# Altium schematic sheet Power.SchDoc
size A3; Author: Швецов С.В.; Organization: PapuaSoft; SheetNumber: 6; SheetTotal: 8
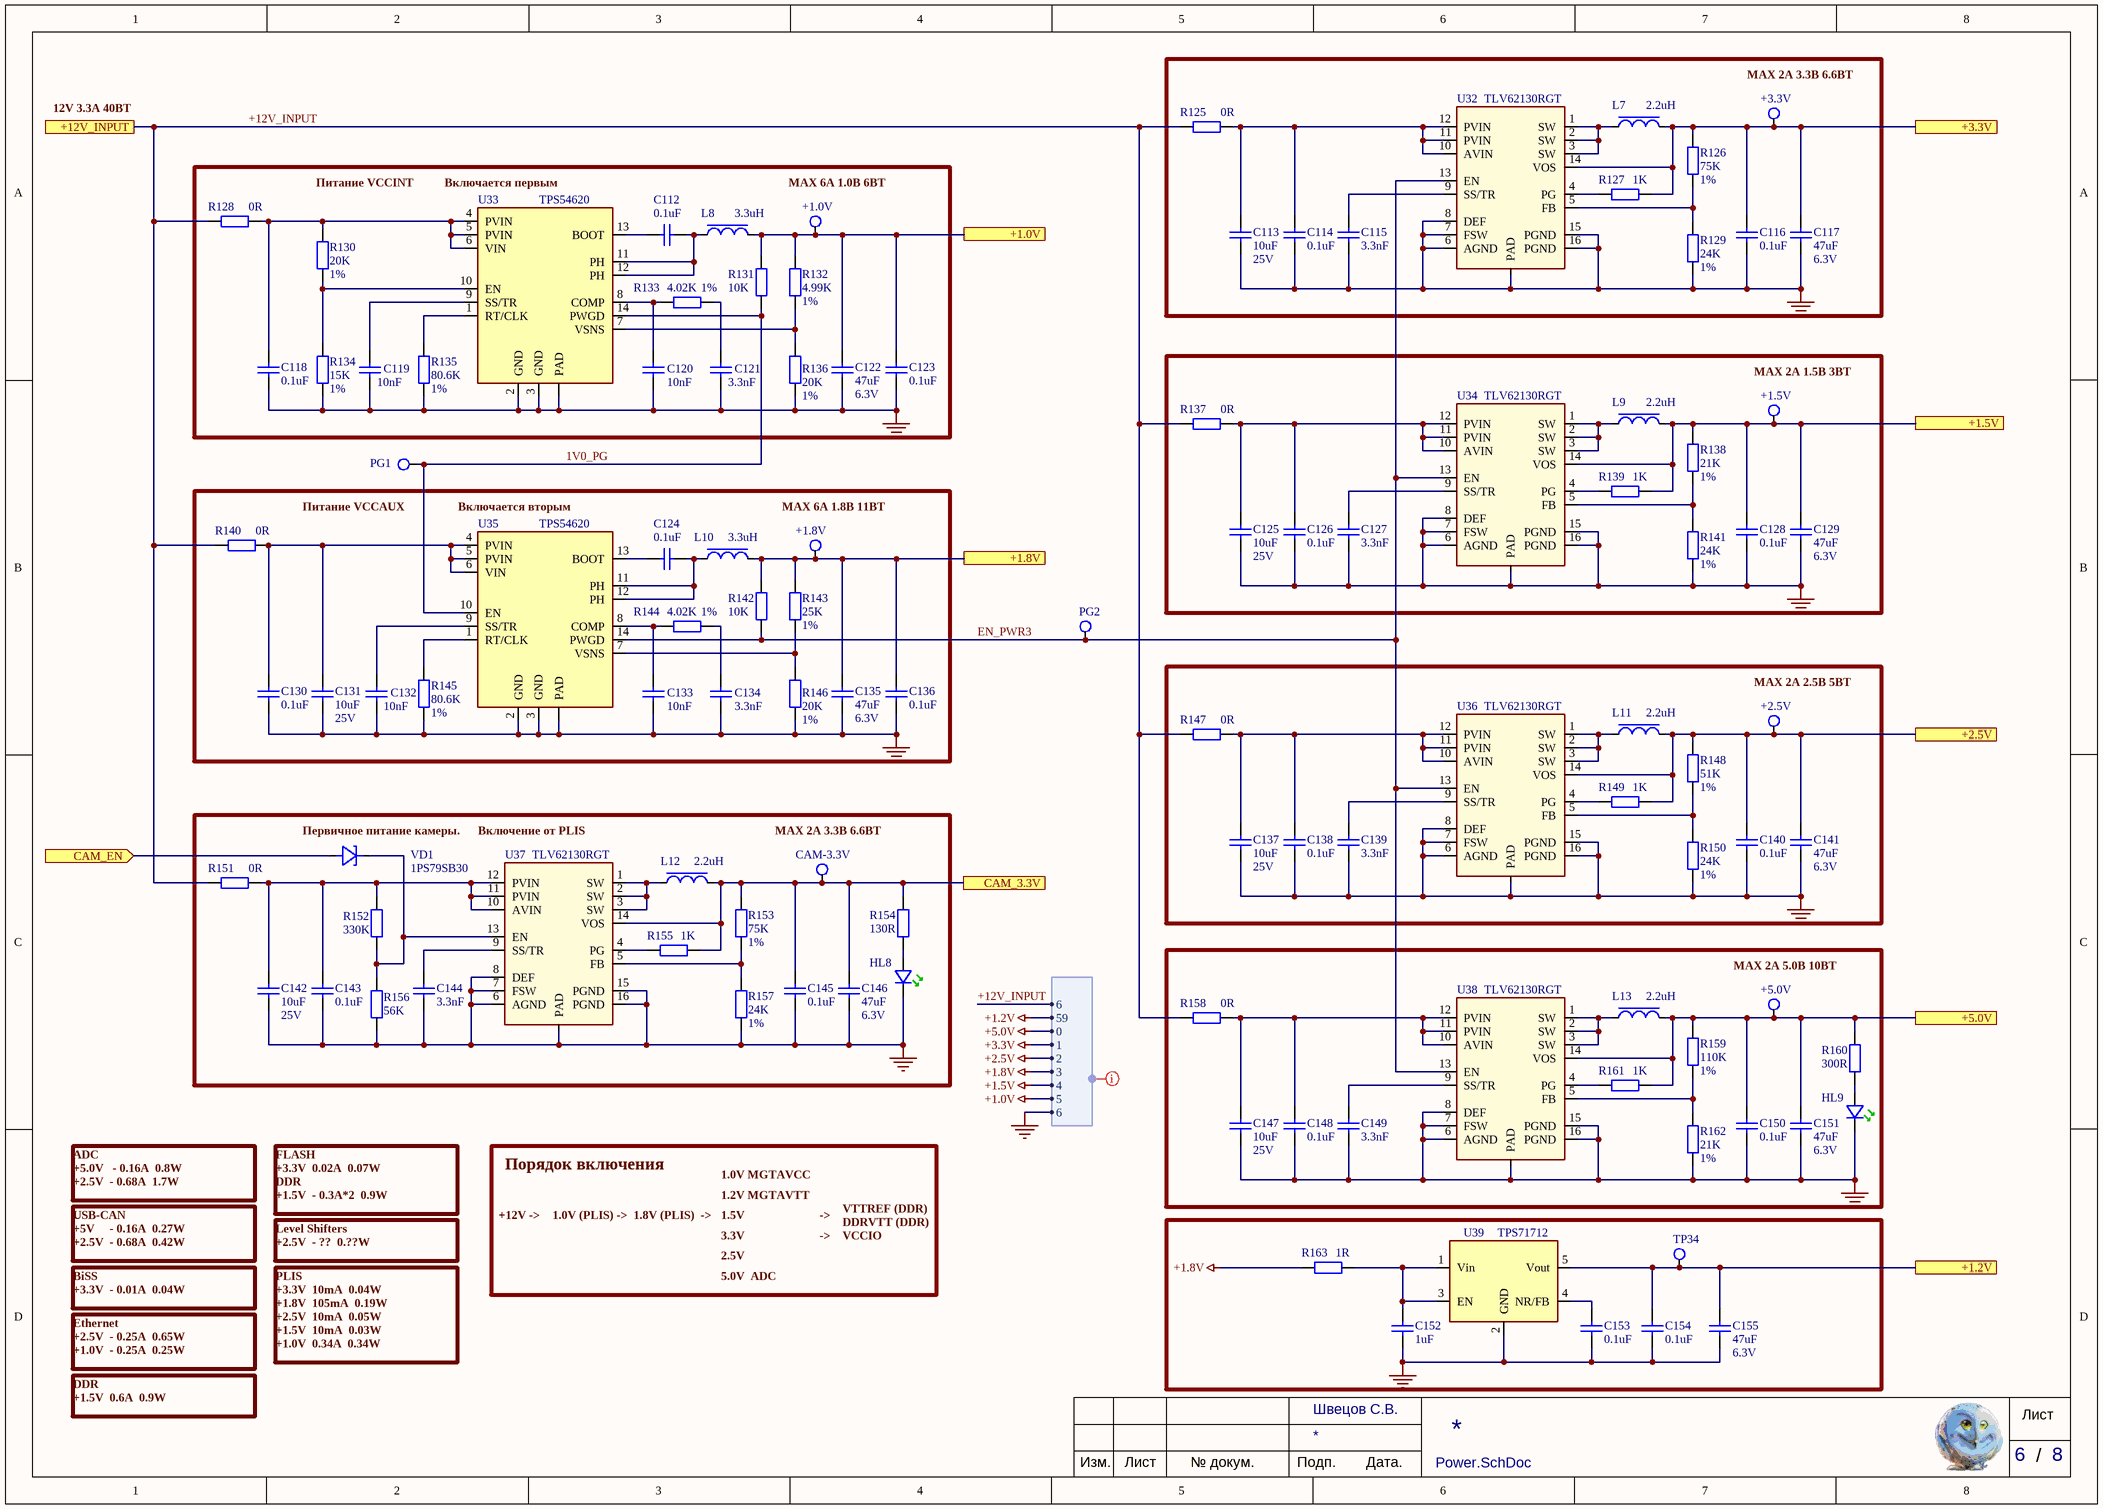
[diagram p0: Power.SchDoc]

## Parts
C112  value 0.1uF  [C0402]  (hidden comment: Cap)
C113  value 10uF  Voltage: 25V  [C0805]  (hidden comment: Cap)
C114  value 0.1uF  [C0402]  (hidden comment: Cap)
C115  value 3.3nF  [C0402]  (hidden comment: Cap)
C116  value 0.1uF  [C0402]  (hidden comment: Cap)
C117  value 47uF  Voltage: 6.3V  [C0805]  (hidden comment: Cap)
C118  value 0.1uF  [C0402]  (hidden comment: Cap)
C119  value 10nF  [C0402]  (hidden comment: Cap)
C120  value 10nF  [C0402]  (hidden comment: Cap)
C121  value 3.3nF  [C0402]  (hidden comment: Cap)
C122  value 47uF  Voltage: 6.3V  [C0805]  (hidden comment: Cap)
C123  value 0.1uF  [C0402]  (hidden comment: Cap)
C124  value 0.1uF  [C0402]  (hidden comment: Cap)
C125  value 10uF  Voltage: 25V  [C0805]  (hidden comment: Cap)
C126  value 0.1uF  [C0402]  (hidden comment: Cap)
C127  value 3.3nF  [C0402]  (hidden comment: Cap)
C128  value 0.1uF  [C0402]  (hidden comment: Cap)
C129  value 47uF  Voltage: 6.3V  [C0805]  (hidden comment: Cap)
C130  value 0.1uF  [C0402]  (hidden comment: Cap)
C131  value 10uF  Voltage: 25V  [C0805]  (hidden comment: Cap)
C132  value 10nF  [C0402]  (hidden comment: Cap)
C133  value 10nF  [C0402]  (hidden comment: Cap)
C134  value 3.3nF  [C0402]  (hidden comment: Cap)
C135  value 47uF  Voltage: 6.3V  [C0805]  (hidden comment: Cap)
C136  value 0.1uF  [C0402]  (hidden comment: Cap)
C137  value 10uF  Voltage: 25V  [C0805]  (hidden comment: Cap)
C138  value 0.1uF  [C0402]  (hidden comment: Cap)
C139  value 3.3nF  [C0402]  (hidden comment: Cap)
C140  value 0.1uF  [C0402]  (hidden comment: Cap)
C141  value 47uF  Voltage: 6.3V  [C0805]  (hidden comment: Cap)
C142  value 10uF  Voltage: 25V  [C0805]  (hidden comment: Cap)
C143  value 0.1uF  [C0402]  (hidden comment: Cap)
C144  value 3.3nF  [C0402]  (hidden comment: Cap)
C145  value 0.1uF  [C0402]  (hidden comment: Cap)
C146  value 47uF  Voltage: 6.3V  [C0805]  (hidden comment: Cap)
C147  value 10uF  Voltage: 25V  [C0805]  (hidden comment: Cap)
C148  value 0.1uF  [C0402]  (hidden comment: Cap)
C149  value 3.3nF  [C0402]  (hidden comment: Cap)
C150  value 0.1uF  [C0402]  (hidden comment: Cap)
C151  value 47uF  Voltage: 6.3V  [C0805]  (hidden comment: Cap)
C152  value 1uF  [C0603]  (hidden comment: Cap)
C153  value 0.1uF  [C0402]  (hidden comment: Cap)
C154  value 0.1uF  [C0402]  (hidden comment: Cap)
C155  value 47uF  Voltage: 6.3V  [C0805]  (hidden comment: Cap)
HL8  (no value)  [KP-1608_16x08x11_L]
HL9  (no value)  [KP-1608_16x08x11_L]
L7  2.2uH  [B82472G6222M000]
L8  3.3uH  [INDPM101101X680N]
L9  2.2uH  [B82472G6222M000]
L10  3.3uH  [INDPM101101X680N]
L11  2.2uH  [B82472G6222M000]
L12  2.2uH  [B82472G6222M000]
L13  2.2uH  [B82472G6222M000]
R125  value 0R  [R0402]  (hidden comment: Res2)
R126  value 75K  Precision: 1%  [R0402]  (hidden comment: Res2)
R127  value 1K  [R0402]  (hidden comment: Res2)
R128  value 0R  [R0402]  (hidden comment: Res2)
R129  value 24K  Precision: 1%  [R0402]  (hidden comment: Res2)
R130  value 20K  Precision: 1%  [R0402]  (hidden comment: Res2)
R131  value 10K  [R0402]  (hidden comment: Res2)
R132  value 4.99K  Precision: 1%  [R0402]  (hidden comment: Res2)
R133  value 4.02K  Precision: 1%  [R0402]  (hidden comment: Res2)
R134  value 15K  Precision: 1%  [R0402]  (hidden comment: Res2)
R135  value 80.6K  Precision: 1%  [R0402]  (hidden comment: Res2)
R136  value 20K  Precision: 1%  [R0402]  (hidden comment: Res2)
R137  value 0R  [R0402]  (hidden comment: Res2)
R138  value 21K  Precision: 1%  [R0402]  (hidden comment: Res2)
R139  value 1K  [R0402]  (hidden comment: Res2)
R140  value 0R  [R0402]  (hidden comment: Res2)
R141  value 24K  Precision: 1%  [R0402]  (hidden comment: Res2)
R142  value 10K  [R0402]  (hidden comment: Res2)
R143  value 25K  Precision: 1%  [R0402]  (hidden comment: Res2)
R144  value 4.02K  Precision: 1%  [R0402]  (hidden comment: Res2)
R145  value 80.6K  Precision: 1%  [R0402]  (hidden comment: Res2)
R146  value 20K  Precision: 1%  [R0402]  (hidden comment: Res2)
R147  value 0R  [R0402]  (hidden comment: Res2)
R148  value 51K  Precision: 1%  [R0402]  (hidden comment: Res2)
R149  value 1K  [R0402]  (hidden comment: Res2)
R150  value 24K  Precision: 1%  [R0402]  (hidden comment: Res2)
R151  value 0R  [R0402]  (hidden comment: Res2)
R152  value 330K  [R0402]  (hidden comment: Res2)
R153  value 75K  Precision: 1%  [R0402]  (hidden comment: Res2)
R154  value 130R  [R0402]  (hidden comment: Res2)
R155  value 1K  [R0402]  (hidden comment: Res2)
R156  value 56K  [R0402]  (hidden comment: Res2)
R157  value 24K  Precision: 1%  [R0402]  (hidden comment: Res2)
R158  value 0R  [R0402]  (hidden comment: Res2)
R159  value 110K  Precision: 1%  [R0402]  (hidden comment: Res2)
R160  value 300R  [R0402]  (hidden comment: Res2)
R161  value 1K  [R0402]  (hidden comment: Res2)
R162  value 21K  Precision: 1%  [R0402]  (hidden comment: Res2)
R163  value 1R  [R0402]  (hidden comment: Res2)
TP25  MarkPCB: +3.3V  [TP_0MM5_1MM0]  (no BOM)
TP26  MarkPCB: +1.0V  [TP_0MM5_1MM0]  (no BOM)
TP27  MarkPCB: +1.5V  [TP_0MM5_1MM0]  (no BOM)
TP28  MarkPCB: PG1  [TP_0MM5_1MM0]  (no BOM)
TP29  MarkPCB: +1.8V  [TP_0MM5_1MM0]  (no BOM)
TP30  MarkPCB: PG2  [TP_0MM5_1MM0]  (no BOM)
TP31  MarkPCB: +2.5V  [TP_0MM5_1MM0]  (no BOM)
TP32  MarkPCB: CAM-3.3V  [TP_0MM5_1MM0]  (no BOM)
TP33  MarkPCB: +5.0V  [TP_0MM5_1MM0]  (no BOM)
TP34  (no value)  [TP_0MM5_1MM0]  (no BOM)
U32  TLV62130RGT  [QFN50P300X300X100-17N-D]
U33  value TPS54620  [RGY-(S-PVQFN-N14)]  (hidden comment: TPS60500)
U34  TLV62130RGT  [QFN50P300X300X100-17N-D]
U35  value TPS54620  [RGY-(S-PVQFN-N14)]  (hidden comment: TPS60500)
U36  TLV62130RGT  [QFN50P300X300X100-17N-D]
U37  TLV62130RGT  [QFN50P300X300X100-17N-D]
U38  TLV62130RGT  [QFN50P300X300X100-17N-D]
U39  value TPS71712  [SOT23_5]
VD1  1PS79SB30  [sod523]

## Ports
+1.0V, +1.2V, +1.5V, +1.8V, +2.5V, +3.3V, +5.0V, +12V_INPUT, CAM_3.3V, CAM_EN (in)

## Harnesses
POWER: 0, 1, 2, 3, 4, 5, 6, 59, 6

## Nets
+1.0V: harness POWER.5
+1.2V: harness POWER.59
+1.5V: harness POWER.4
+1.8V: R163.2 ; harness POWER.3
+2.5V: harness POWER.2
+3.3V: harness POWER.1
+5.0V: harness POWER.0
+12V_INPUT: C113.2 C114.2 C115.2 C116.2 C117.2 C118.2 C119.1 C120.1 C121.1 C122.2 C123.2 C125.2 C126.2 C127.2 C128.2 C129.2 C130.2 C131.2 C132.1 C133.1 C134.1 C135.2 C136.2 C137.2 C138.2 C139.2 C140.2 C141.2 C142.2 C143.2 C144.2 C145.2 C146.2 C147.2 C148.2 C149.2 C150.2 C151.2 C152.2 C153.2 C154.2 C155.2 HL8.2(Cathode) HL9.2(Cathode) R125.2 R128.2 R129.1 R134.2 R135.1 R136.1 R137.2 R140.2 R141.1 R145.1 R146.1 R147.2 R150.1 R151.2 R156.1 R157.1 R158.2 R162.1 U32.0(PAD) U32.6(AGND) U32.7(FSW) U32.8(DEF) U32.15(PGND) U32.16(PGND) U33.0(PAD) U33.2(GND) U33.3(GND) U34.0(PAD) U34.6(AGND) U34.7(FSW) U34.8(DEF) U34.15(PGND) U34.16(PGND) U35.0(PAD) U35.2(GND) U35.3(GND) U36.0(PAD) U36.6(AGND) U36.7(FSW) U36.8(DEF) U36.15(PGND) U36.16(PGND) U37.0(PAD) U37.6(AGND) U37.7(FSW) U37.8(DEF) U37.15(PGND) U37.16(PGND) U38.0(PAD) U38.6(AGND) U38.7(FSW) U38.8(DEF) U38.15(PGND) U38.16(PGND) U39.2(GND) ; port +12V_INPUT, harness POWER.6  [also labelled GND]
1V0_PG: R131.1 TP28.1(e1) U33.14(PWGD) U35.10(EN)
+1.0V: C122.1 C123.1 L8.1 R131.2 R132.2 TP26.1(e1) ; port +1.0V  [a separate net that carries the same name]
+1.2V: C154.1 C155.1 TP34.1(e1) U39.5(Vout) ; port +1.2V  [a separate net that carries the same name]
+1.5V: C128.1 C129.1 L9.1 R138.1 R139.1 TP27.1(e1) U34.14(VOS) ; port +1.5V  [a separate net that carries the same name]
+1.8V: C135.1 C136.1 L10.1 R142.2 R143.2 TP29.1(e1) ; port +1.8V  [a separate net that carries the same name]
+2.5V: C140.1 C141.1 L11.1 R148.1 R149.1 TP31.1(e1) U36.14(VOS) ; port +2.5V  [a separate net that carries the same name]
+3.3V: C116.1 C117.1 L7.1 R126.1 R127.1 TP25.1(e1) U32.14(VOS) ; port +3.3V  [a separate net that carries the same name]
+5.0V: C150.1 C151.1 L13.1 R159.1 R160.2 R161.1 TP33.1(e1) U38.14(VOS) ; port +5.0V  [a separate net that carries the same name]
CAM_3.3V: C145.1 C146.1 L12.1 R153.1 R154.2 R155.1 TP32.1(e1) U37.14(VOS) ; port CAM_3.3V
CAM_EN: VD1.2 ; port CAM_EN
EN_PWR3: R142.1 TP30.1(e1) U32.13(EN) U34.13(EN) U35.14(PWGD) U36.13(EN) U38.13(EN)
NetC112_1: C112.1 U33.13(BOOT)
NetC112_2: C112.2 L8.2 U33.11(PH) U33.12(PH)
NetC113_1: C113.1 C114.1 R125.1 U32.10(AVIN) U32.11(PVIN) U32.12(PVIN)
NetC115_1: C115.1 U32.9(SS/TR)
NetC118_1: C118.1 R128.1 R130.1 U33.4(PVIN) U33.5(PVIN) U33.6(VIN)
NetC119_2: C119.2 U33.9(SS/TR)
NetC120_2: C120.2 R133.1 U33.8(COMP)
NetC121_2: C121.2 R133.2
NetC124_1: C124.1 U35.13(BOOT)
NetC124_2: C124.2 L10.2 U35.11(PH) U35.12(PH)
NetC125_1: C125.1 C126.1 R137.1 U34.10(AVIN) U34.11(PVIN) U34.12(PVIN)
NetC127_1: C127.1 U34.9(SS/TR)
NetC130_1: C130.1 C131.1 R140.1 U35.4(PVIN) U35.5(PVIN) U35.6(VIN)
NetC132_2: C132.2 U35.9(SS/TR)
NetC133_2: C133.2 R144.1 U35.8(COMP)
NetC134_2: C134.2 R144.2
NetC137_1: C137.1 C138.1 R147.1 U36.10(AVIN) U36.11(PVIN) U36.12(PVIN)
NetC139_1: C139.1 U36.9(SS/TR)
NetC142_1: C142.1 C143.1 R151.1 R152.2 U37.10(AVIN) U37.11(PVIN) U37.12(PVIN)
NetC144_1: C144.1 U37.9(SS/TR)
NetC147_1: C147.1 C148.1 R158.1 U38.10(AVIN) U38.11(PVIN) U38.12(PVIN)
NetC149_1: C149.1 U38.9(SS/TR)
NetC152_1: C152.1 R163.1 U39.1(Vin) U39.3(EN)
NetC153_1: C153.1 U39.4(NR/FB)
NetHL8_1: HL8.1(Anode) R154.1
NetHL9_1: HL9.1(Anode) R160.1
NetL7_2: L7.2 U32.1(SW) U32.2(SW) U32.3(SW)
NetL9_2: L9.2 U34.1(SW) U34.2(SW) U34.3(SW)
NetL11_2: L11.2 U36.1(SW) U36.2(SW) U36.3(SW)
NetL12_2: L12.2 U37.1(SW) U37.2(SW) U37.3(SW)
NetL13_2: L13.2 U38.1(SW) U38.2(SW) U38.3(SW)
NetR126_2: R126.2 R129.2 U32.5(FB)
NetR127_2: R127.2 U32.4(PG)
NetR130_2: R130.2 R134.1 U33.10(EN)
NetR132_1: R132.1 R136.2 U33.7(VSNS)
NetR135_2: R135.2 U33.1(RT/CLK)
NetR138_2: R138.2 R141.2 U34.5(FB)
NetR139_2: R139.2 U34.4(PG)
NetR143_1: R143.1 R146.2 U35.7(VSNS)
NetR145_2: R145.2 U35.1(RT/CLK)
NetR148_2: R148.2 R150.2 U36.5(FB)
NetR149_2: R149.2 U36.4(PG)
NetR152_1: R152.1 R156.2 U37.13(EN) VD1.1
NetR153_2: R153.2 R157.2 U37.5(FB)
NetR155_2: R155.2 U37.4(PG)
NetR159_2: R159.2 R162.2 U38.5(FB)
NetR161_2: R161.2 U38.4(PG)

## Layout directives
net class POWER: (no net found under the mark)

## Notes on the sheet
- 12V 3.3A 40ВТ
- (near TP25) MAX 2A 3.3В 6.6ВТ
- (near U33) Включается первым
- MAX 6A 1.0В 6ВТ
- Питание VCCINT
- (near TP27) MAX 2A 1.5В 3ВТ
- (near TP28) Питание VCCAUX
- (near U35) Включается вторым
- MAX 6A 1.8В 11ВТ
- (near TP31) MAX 2A 2.5В 5ВТ
- (near VD1) Первичное питание камеры.
- (near U37) Включение от PLIS
- (near TP32) MAX 2A 3.3В 6.6ВТ
- (near TP33) MAX 2A 5.0В 10ВТ
- Порядок включения
- 1.0V MGTAVCC
- USB-CAN
  +5V     - 0.16A  0.27W
  +2.5V  - 0.68A  0.42W
- ADC
  +5.0V   - 0.16A  0.8W
  +2.5V  - 0.68A  1.7W
- FLASH
  +3.3V  0.02A  0.07W
  DDR
  +1.5V  - 0.3A*2  0.9W
- Level Shifters
  +2.5V  - ??  0.??W
- +12V ->
- 1.0V (PLIS) ->
- 1.8V (PLIS)  ->
- 1.5V                         ->
- 3.3V                         ->
- 1.2V MGTAVTT
- 2.5V
- VCCIO ->
- DDRVTT (DDR)
- VTTREF (DDR)
- BiSS
  +3.3V  - 0.01A  0.04W
- 5.0V  ADC
- Ethernet
  +2.5V  - 0.25A  0.65W
  +1.0V  - 0.25A  0.25W
- PLIS
  +3.3V  10mA  0.04W
  +1.8V  105mA  0.19W
  +2.5V  10mA  0.05W
  +1.5V  10mA  0.03W
  +1.0V  0.34A  0.34W
- DDR
  +1.5V  0.6A  0.9W
- Лист
- /
- Изм.
- № докум.
- Подп.
- Дата.

## Library data of the parts
C112 C114-C116 C118-C121 C123 C124 C126-C128 C130 C132-C134 C136 C138-C140 C143-C145 C148-C150 C153 C154 = Cap: Конденсатор керамический; Voltage: 25V; PackageReference: 0402
  C112 C118-C121 C123: ClassName: Power1.0
  C114-C116: ClassName: Power3.3
  C124 C130 C132-C134 C136: ClassName: Power1.8
  C126-C128: ClassName: Power1.5
  C138-C140: ClassName: Power2.5
  C143-C145: ClassName: Power33cam
  C148-C150: ClassName: Power5.0
C113 C125 C131 C137 C142 C147 = Cap: GRM21BR61E106KA73L; PackageReference: 0805
  C113: ClassName: Power3.3
  C125: ClassName: Power1.5
  C137: ClassName: Power2.5
  C142: ClassName: Power33cam
  C147: ClassName: Power5.0
C117 C122 C129 C135 C141 C146 C151 C155 = Cap: C0805C476M9PAC; PackageReference: 0805
  C117: ClassName: Power3.3
  C122: ClassName: Power1.0
  C129: ClassName: Power1.5
  C135: ClassName: Power1.8
  C141: ClassName: Power2.5
  C146: ClassName: Power33cam
  C151: ClassName: Power5.0
C152 = Cap: Конденсатор керамический; PackageReference: 0603
HL8 HL9 = ledG_KP-1608MGC_KP-1608: 1.6X0.8mm SMD  LED; LxWxH(mm): 1,6x0,8x1,1; Value: KP-1608MGC; PackageReference: 0603; Package: KP-1608_16x08x11
L7 L9 L11-L13 = LPS4012: 2.2uH, 3.4A, 0.047R; Value: B82472G6222M000
  L7: ClassName: Power3.3
  L9: ClassName: Power1.5
  L11: ClassName: Power2.5
  L12: ClassName: Power33cam
  L13: ClassName: Power5.0
L8 L10 = LPS4012: 3.3uH, 6.4A, 12.5mΩ; Value: SLF10165T-3R3N5R83PF
  L8: ClassName: Power1.0
  L10: ClassName: Power1.8
R125-R163 = Res2: Резистор; PackageReference: 0402
  R125-R127 R129: ClassName: Power3.3
  R128 R131-R133 R135 R136: ClassName: Power1.0
  R137-R139 R141: ClassName: Power1.5
  R140 R142-R146: ClassName: Power1.8
  R147-R150: ClassName: Power2.5
  R151-R153 R155-R157: ClassName: Power33cam
  R158 R159 R161 R162: ClassName: Power5.0
TP25-TP33 = Test_Point: Тестовая точка на плате
  TP25: ClassName: Power3.3
  TP26 TP28: ClassName: Power1.0
  TP27: ClassName: Power1.5
  TP29 TP30: ClassName: Power1.8
  TP31: ClassName: Power2.5
  TP32: ClassName: Power33cam
  TP33: ClassName: Power5.0
TP34 = Test_Point: Тестовая точка на плате; MarkPCB: +1.2V
U32 U34 U36-U38 = TLV62130RGT: 3V to 17V 3A Step-Down Converter; PackageReference: VQFN-16; Value: TLV62130RGT
  U32: ClassName: Power3.3
  U34: ClassName: Power1.5
  U36: ClassName: Power2.5
  U37: ClassName: Power33cam
  U38: ClassName: Power5.0
U33 U35 = TPS54620: 4.5V to 17V  6A Step-down Converter; PackageReference: VQFN-14
  U33: ClassName: Power1.0
  U35: ClassName: Power1.8
U39 = TPS71701: Линейный стабилизатор +1.2В; PackageReference: SC70-5; Parameter 1: *
VD1 = MSS1P3L: Диод Шоттки 40В 0.2А; Value: 1PS79SB30,115; PackageReference: SOD523